# Altium schematic sheet MultimediaEthernet_SD.SchDoc
size Letter
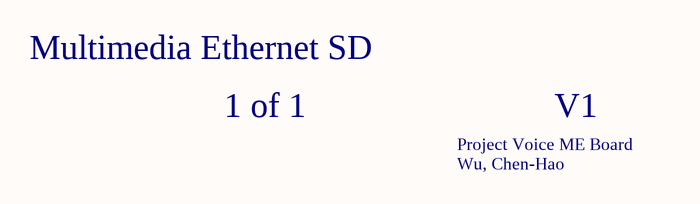
[diagram p0: MultimediaEthernet_SD.SchDoc]

## Notes on the sheet
- Multimedia Ethernet SD
- 1 of 1
- Project Voice ME Board
- V1
- Wu, Chen-Hao